# Altium schematic sheet Sheet1.SchDoc
size A4; SheetNumber: 1; SheetTotal: 1
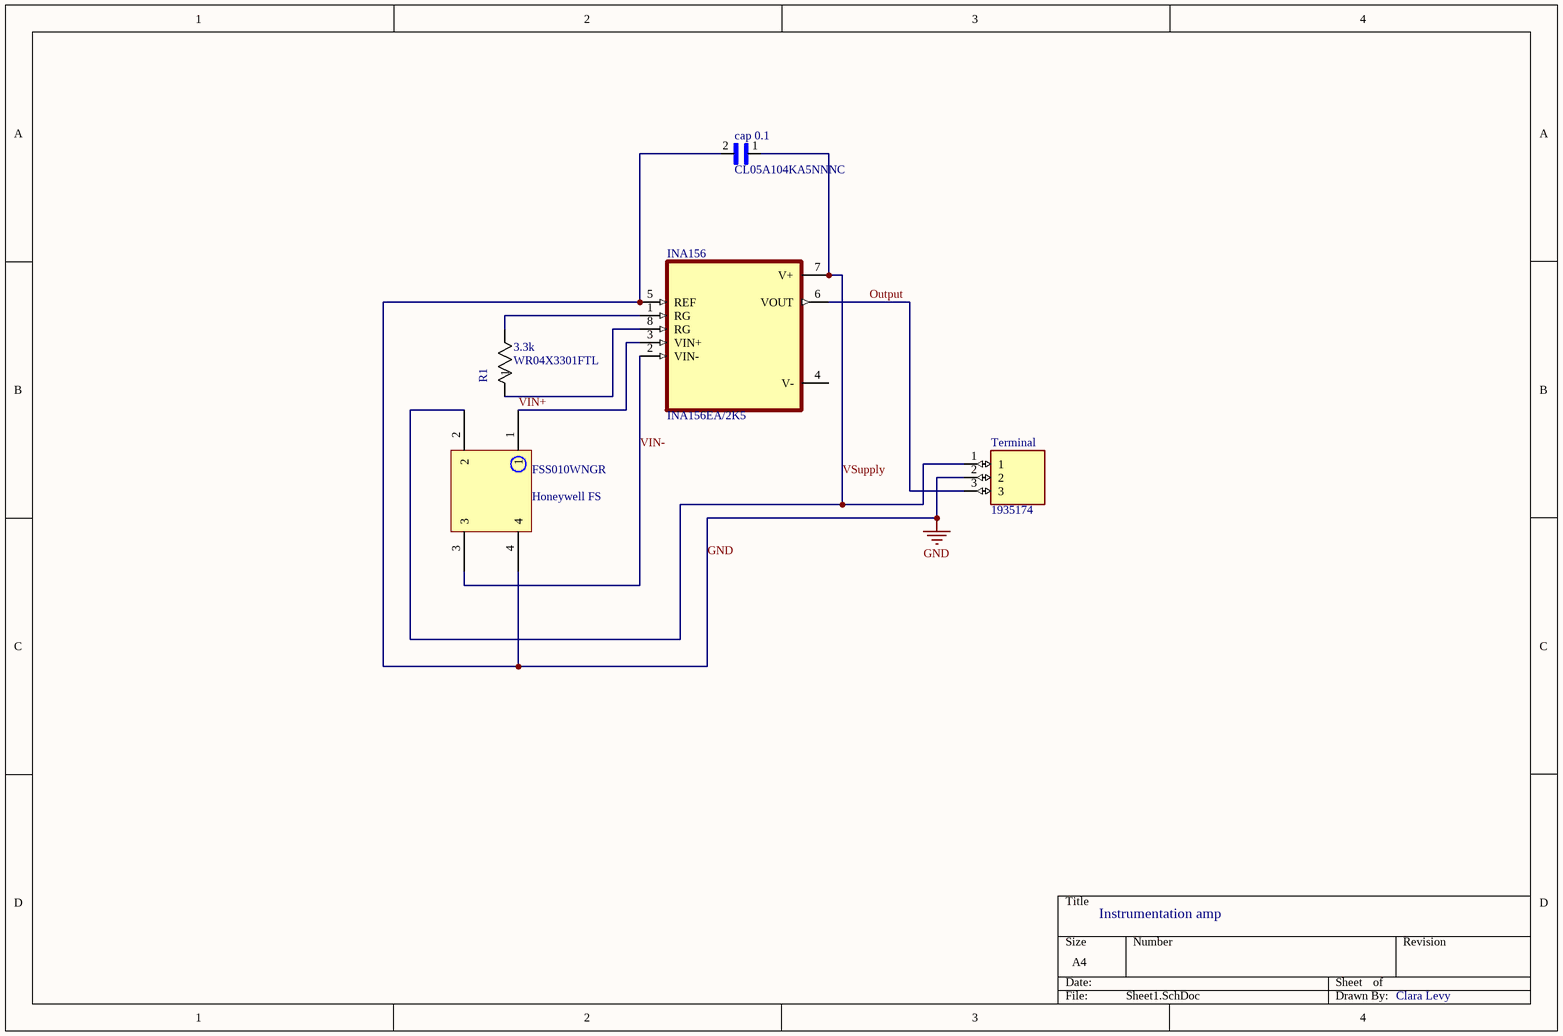
[diagram p0: Sheet1.SchDoc]

## Parts
3.3k  WR04X3301FTL  [RES_WR04_WRE-M]
cap_0.1  CL05A104KA5NNNC  [CAPC1005X55N]
Honeywell_FS  FSS010WNGR  [FSS010 - duplicate]
INA156  INA156EA/2K5  [SOP65P490X110-8N]
Terminal  1935174  [Supply terminal]

## Nets
GND: cap_0.1.2 Honeywell_FS.4 INA156.5(REF) Terminal.2
Output: INA156.6(VOUT) Terminal.3
VIN+: Honeywell_FS.1 INA156.3(VIN+)
VIN-: Honeywell_FS.3 INA156.2(VIN-)
VSupply: cap_0.1.1 Honeywell_FS.2 INA156.7(V+) Terminal.1
Net3.3k_1: 3.3k.1 INA156.8(RG)
Net3.3k_2: 3.3k.2 INA156.1(RG)

Not connected (* = marked no-connect by the designer): INA156 4(V-)

## Notes on the sheet
- Instrumentation amp
- Clara Levy
- (in symbol WR04X3301FTL) R1

## Library data of the parts
3.3k = WR04X3301FTL: No Description Available; Mfr_Name: Walsin; Digi-Key_Part_Number_3: 1292-WR04X3301FTLDKR-ND; Digi-Key_Part_Number_2: 1292-WR04X3301FTLCT-ND; Digi-Key_Part_Number_1: 1292-WR04X3301FTLTR-ND
cap_0.1 = CL05A104KA5NNNC: 0.1ÂµF Â±10% 25V Ceramic Capacitor X5R 0402 (1005 Metric); MF: Samsung Electro-Mechanics; SnapEDA_Link: https://www.snapeda.com/parts/CL05A104KA5NNNC/Samsung%20Electro-Mechanics/view-part/553880/?ref=snap; Value: *; Check_prices: https://www.snapeda.com/parts/CL05A104KA5NNNC/Samsung%20Electro-Mechanics/view-part/553880/?ref=eda; Digi-Key_Part_Number: 1276-1043-1-ND; Package: 0402 Samsung; MP: CL05A104KA5NNNC; Purchase-URL: https://pricing.snapeda.com/search/part/CL05A104KA5NNNC/?ref=eda
Honeywell_FS = FSS010WNGR: Force Sensor Ratiometric-OUT 4-Pin SMD T/R; Manufacturer: Honeywell Sensing & Control; Supplier: Digi-Key; Supplier Part Number: FSS010WNGR-ND; Manufacturer Part Number: FSS010WNGR; RoHS: Yes; Category: Sensors; Pricing: 25=88.7196 (USD); ComponentLink1URL: http://sensing.honeywell.com/index.php?ci_id=44994&src-supplier=Digi-Key; ComponentLink1Description: http://sensing.honeywell.com/index.php?ci_id=44994&src-supplier=Digi-Key; ComponentLink2URL: http://sensing.honeywell.com/index.php?ci_id=50144&src-supplier=Mouser; ComponentLink2Description: http://sensing.honeywell.com/index.php?ci_id=50144&src-supplier=Mouser
Terminal = 1935174: MF: {'manufacturer': u'Phoenix Contact'}; Package: None; Price: None; Value: *; MP: 1935174; Availability: Unavailable
INA156 = INA156EA/2K5: Package: None; Price: None; Value: *; MP: INA156EA/2K5; Availability: Unavailable